# Altium schematic sheet Con_nb3000_ledkb.schdoc: LED and Button Ext. Connector
size A4; DocumentNumber: 65; SheetNumber: 66; SheetTotal: 78
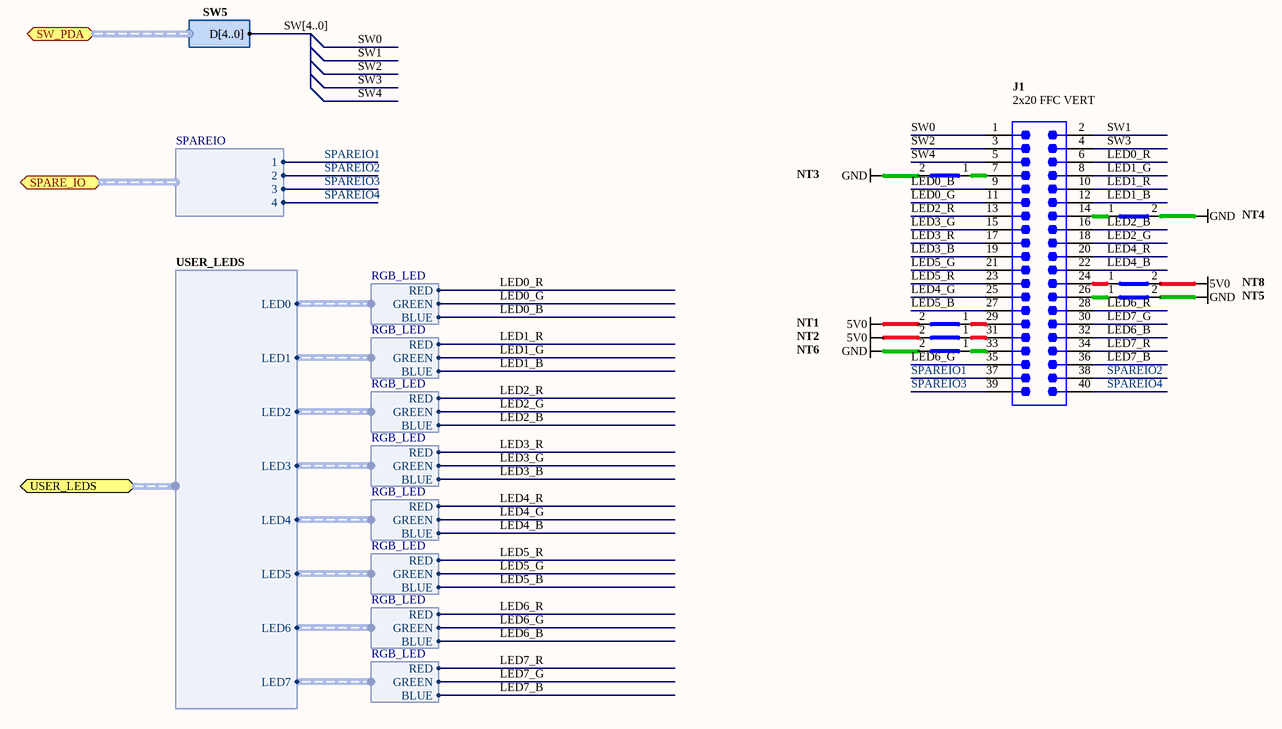
[diagram p0: Con_nb3000_ledkb.schdoc]

## Parts
J1  2x20 FFC VERT  [FPC-xxS1VN3R]
NT1  Net Tie SMT2  [NETTIE-SMT2-8X8]  (value not drawn)  (net tie, no BOM)
NT2  Net Tie SMT2  [NETTIE-SMT2-8X8]  (value not drawn)  (net tie, no BOM)
NT3  Net Tie SMT2  [NETTIE-SMT2-8X8]  (value not drawn)  (net tie, no BOM)
NT4  Net Tie SMT2  [NETTIE-SMT2-8X8]  (value not drawn)  (net tie, no BOM)
NT5  Net Tie SMT2  [NETTIE-SMT2-8X8]  (value not drawn)  (net tie, no BOM)
NT6  Net Tie SMT2  [NETTIE-SMT2-8X8]  (value not drawn)  (net tie, no BOM)
NT8  Net Tie SMT2  [NETTIE-SMT2-8X8]  (value not drawn)  (net tie, no BOM)

## Ports
SPARE_IO (harness SPAREIO), SW_PDA (harness SW5), USER_LEDS (harness USER_LEDS)

## Harnesses
SW5: D[4..0]
SPAREIO: 1, 2, 3, 4
USER_LEDS: LED0, LED1, LED2, LED3, LED4, LED5, LED6, LED7
RGB_LED: RED, GREEN, BLUE

## Nets
5V0: NT1.2(Net2) NT2.2(Net2) NT8.2(Net2)
GND: NT3.2(Net2) NT4.2(Net2) NT5.2(Net2) NT6.2(Net2)
LED0_B: J1.9 ; harness RGB_LED.BLUE
LED0_G: J1.11 ; harness RGB_LED.GREEN
LED0_R: J1.6 ; harness RGB_LED.RED
LED1_B: J1.12 ; harness RGB_LED.BLUE
LED1_G: J1.8 ; harness RGB_LED.GREEN
LED1_R: J1.10 ; harness RGB_LED.RED
LED2_B: J1.16 ; harness RGB_LED.BLUE
LED2_G: J1.18 ; harness RGB_LED.GREEN
LED2_R: J1.13 ; harness RGB_LED.RED
LED3_B: J1.19 ; harness RGB_LED.BLUE
LED3_G: J1.15 ; harness RGB_LED.GREEN
LED3_R: J1.17 ; harness RGB_LED.RED
LED4_B: J1.22 ; harness RGB_LED.BLUE
LED4_G: J1.25 ; harness RGB_LED.GREEN
LED4_R: J1.20 ; harness RGB_LED.RED
LED5_B: J1.27 ; harness RGB_LED.BLUE
LED5_G: J1.21 ; harness RGB_LED.GREEN
LED5_R: J1.23 ; harness RGB_LED.RED
LED6_B: J1.32 ; harness RGB_LED.BLUE
LED6_G: J1.35 ; harness RGB_LED.GREEN
LED6_R: J1.28 ; harness RGB_LED.RED
LED7_B: J1.36 ; harness RGB_LED.BLUE
LED7_G: J1.30 ; harness RGB_LED.GREEN
LED7_R: J1.34 ; harness RGB_LED.RED
SPAREIO1: J1.37 ; port SPARE_IO.1
SPAREIO2: J1.38 ; port SPARE_IO.2
SPAREIO3: J1.39 ; port SPARE_IO.3
SPAREIO4: J1.40 ; port SPARE_IO.4
SW0: J1.1
SW1: J1.2
SW2: J1.3
SW3: J1.4
SW4: J1.5
NetJ1_7: J1.7 NT3.1(Net1)
NetJ1_14: J1.14 NT4.1(Net1)
NetJ1_24: J1.24 NT8.1(Net1)
NetJ1_26: J1.26 NT5.1(Net1)
NetJ1_29: J1.29 NT1.1(Net1)
NetJ1_31: J1.31 NT2.1(Net1)
NetJ1_33: J1.33 NT6.1(Net1)

## Buses and harness runs
bus SW[4..0]

## Notes on the sheet
- Sheet Title
- Project Title
- Size:
- Date:
- A4
- Assy:
- Time:
- Revision:
- Sheet
- of
- File:

## Library data of the parts
J1 = D-300-0125: Header FFC, 2x20 pin Vertical, 0.5mm; Connector type: Straight; Max Current: mA; Mounting Technology: Surface Mount; Pin Count: 40; Status: Unreleased; Category: Connector
NT1-NT6 NT8 = D-002-0003: Net-Tie, Surface Mount, 2 x 1.6mm x 0.8mm SMT Pads - For 0.8mm Track; Category: Net-Tie; Status: Production